# EAGLE design simon_shield (EAGLE 6.5.0)
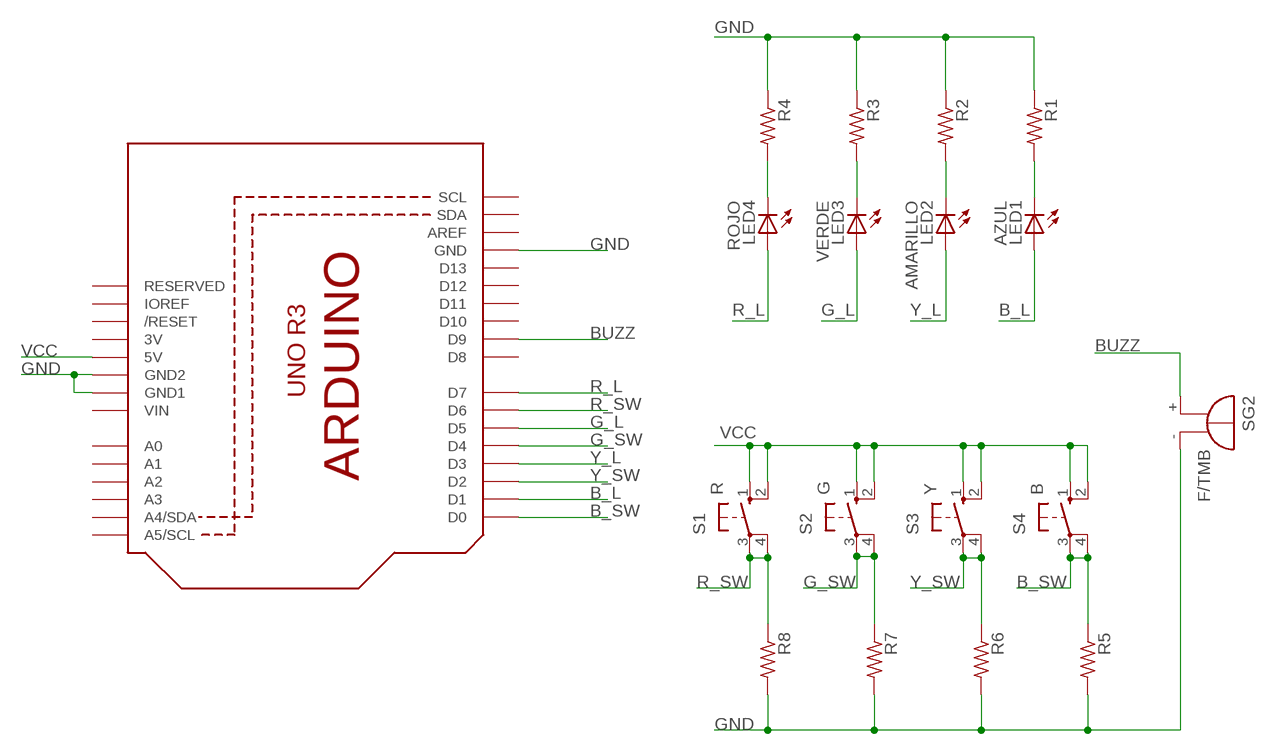
[diagram p0: schematic, sheet 1]

## Parts
LED1  AZUL  LED5MM  [LED5MM]
LED2  AMARILLO  LED5MM  [LED5MM]
LED3  VERDE  LED5MM  [LED5MM]
LED4  ROJO  LED5MM  [LED5MM]
R1  R-US_0207/10  [0207/10]
R2  R-US_0207/10  [0207/10]
R3  R-US_0207/10  [0207/10]
R4  R-US_0207/10  [0207/10]
R5  R-US_0207/10  [0207/10]
R6  R-US_0207/10  [0207/10]
R7  R-US_0207/10  [0207/10]
R8  R-US_0207/10  [0207/10]
S1  R  10-XX  [B3F-10XX]
S2  G  10-XX  [B3F-10XX]
S3  Y  10-XX  [B3F-10XX]
S4  B  10-XX  [B3F-10XX]
SG2  F/TMB  [F/TMB]
U1  ARDUINOR3-DIMENSION  [ARDUINOR3]

## Nets
B_L: LED1.A U1.D1
B_SW: R5.1 S4.3(P) S4.4(P1) U1.D0
BUZZ: SG2.+ U1.D9
G_L: LED3.A U1.D5
G_SW: R7.1 S2.3(P) S2.4(P1) U1.D4
GND: R1.1 R2.1 R3.1 R4.1 R5.2 R6.2 R7.2 R8.2 SG2.- U1.GND U1.GND1 U1.GND2
N$1: LED4.K(C) R4.2
N$2: LED3.K(C) R3.2
N$12: LED2.K(C) R2.2
N$13: LED1.K(C) R1.2
R_L: LED4.A U1.D7
R_SW: R8.1 S1.3(P) S1.4(P1) U1.D6
VCC: S1.1(S) S1.2(S1) S2.1(S) S2.2(S1) S3.1(S) S3.2(S1) S4.1(S) S4.2(S1) U1.5V
Y_L: LED2.A U1.D3
Y_SW: R6.1 S3.3(P) S3.4(P1) U1.D2
Unconnected: U1.A0 U1.A1 U1.A2 U1.A3 U1.A4(A4/SDA) U1.A5(A5/SCL) U1.AREF U1.D8 U1.D10 U1.D11 U1.D12 U1.D13 U1.IOREF U1.RESERVED U1.RESET(/RESET) U1.SCL U1.SDA

## Power pins joined to a net without a drawn wire
3V: U1.3V
VIN: U1.VIN

## Library data of the parts
LED1-LED4 = adafruit:LED: LED OSRAM: - CHIPLED LG R971, LG N971, LY N971, LG Q971, LY Q971, LO R971, LY R971 LH N974, LH R974 LS Q976, LO Q976, LY Q976 LO Q996 - Hyper CHIPLED LW Q18S LB Q993, LB Q99A, LB R99A - SideLED LS A670, LO A670, LY A670, LG A670, LP A670 LB A673, LV A673, LT A673, LW A673 LH A674 LY A675 LS A676, LA A676, LO A676, LY A676, LW A676 LS A679, LY A679, LG A679 - Hyper Micro SIDELED® LS Y876, LA Y876, LO Y876, LY Y876 LT Y87S - SmartLED LW L88C, LW L88S LB L89C, LB L89S, LG L890 LS L89K, LO L89K, LY L89K LS L896, LA L896, LO L896, LY L896 - TOPLED LS T670, LO T670, LY T670, LG T670, LP T670 LSG T670, LSP T670, LSY T670, LOP T670, LYG T670 LG T671, LOG T671, LSG T671 LB T673, LV T673, LT T673, LW T673 LH T674 LS T676, LA T676, LO T676, LY T676, LB T676, LH T676, LSB T676, LW T676 LB T67C, LV T67C, LT T67C, LS T67K, LO T67K, LY T67K, LW E67C LS E67B, LA E67B, LO E67B, LY E67B, LB E67C, LV E67C, LT E67C LW T67C LS T679, LY T679, LG T679 LS T770, LO T770, LY T770, LG T770, LP T770 LB T773, LV T773, LT T773, LW T773 LH T774 LS E675, LA E675, LY E675, LS T675 LS T776, LA T776, LO T776, LY T776, LB T776 LHGB T686 LT T68C, LB T68C - Hyper Mini TOPLED® LB M676 - Mini TOPLED Santana® LG M470 LS M47K, LO M47K, LY M47K Source: http://www.osram.convergy.de/
R1-R8 = adafruit:R-US_: RESISTOR, American symbol
S1-S4 = switch-omron:10-XX: OMRON SWITCH; MPN: B3F-1000; OC_FARNELL: 176432; OC_NEWARK: 36M3542
SG2 = buzzer:F/TMB: BUZZER Source: Buerklin; OC_FARNELL: unknown; OC_NEWARK: unknown
U1 = adafruit:ARDUINOR3: This is a new object for the new Arduino R3 - with extra pins that you may want to use (such as IOref, and duplicated A4/A5

## Board
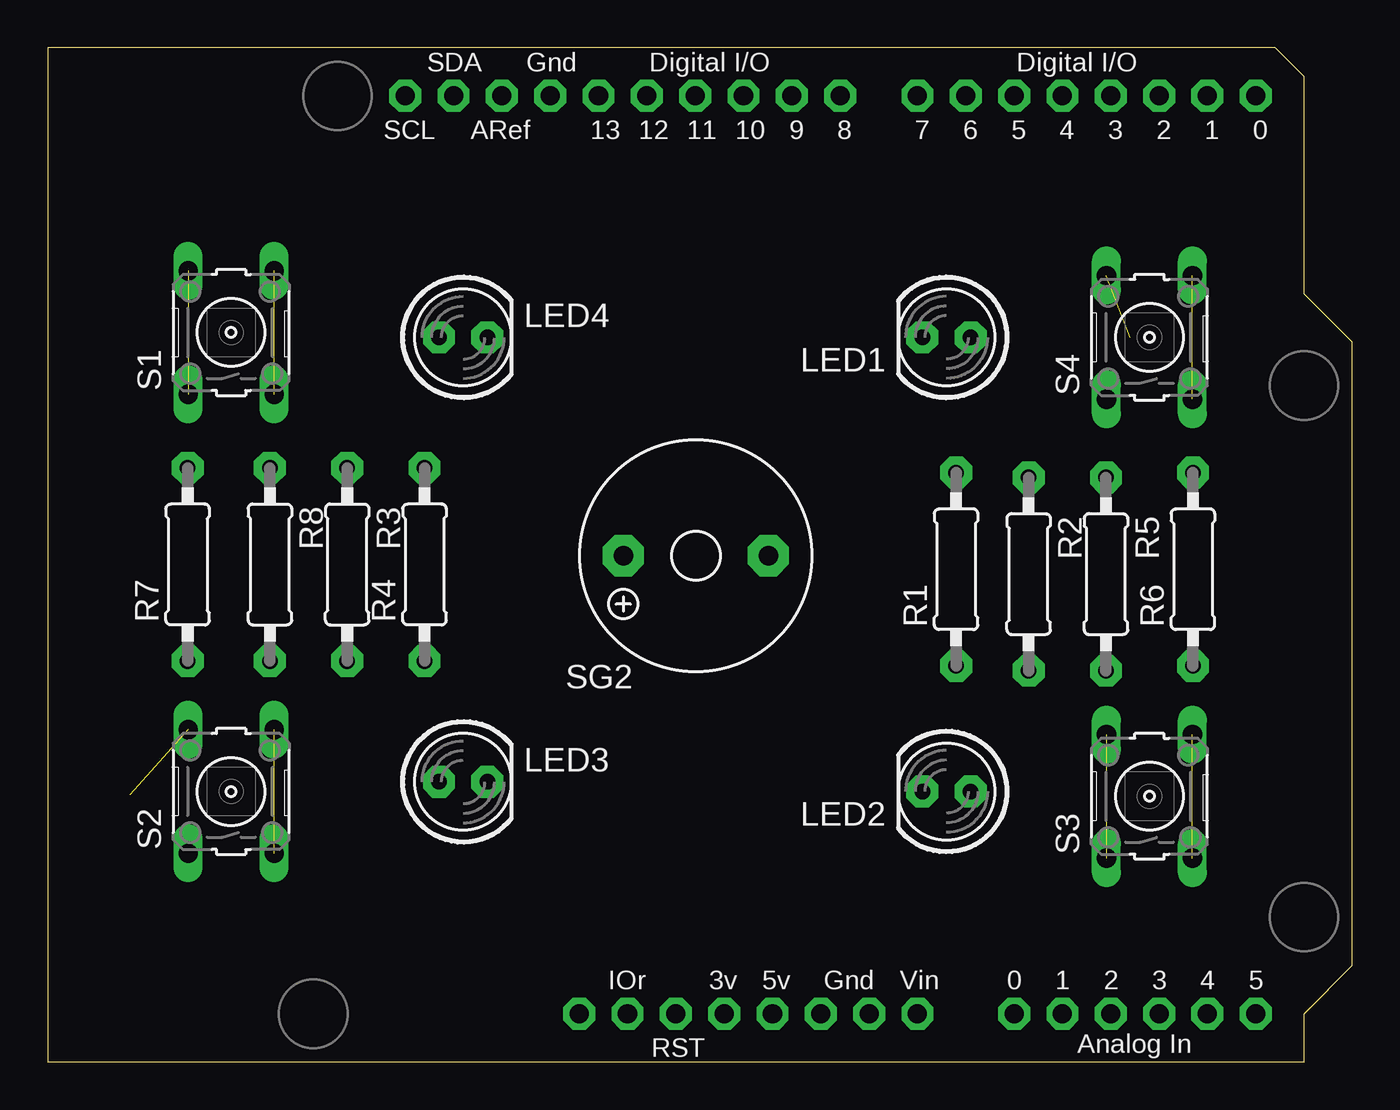
[diagram p1: board, top side]
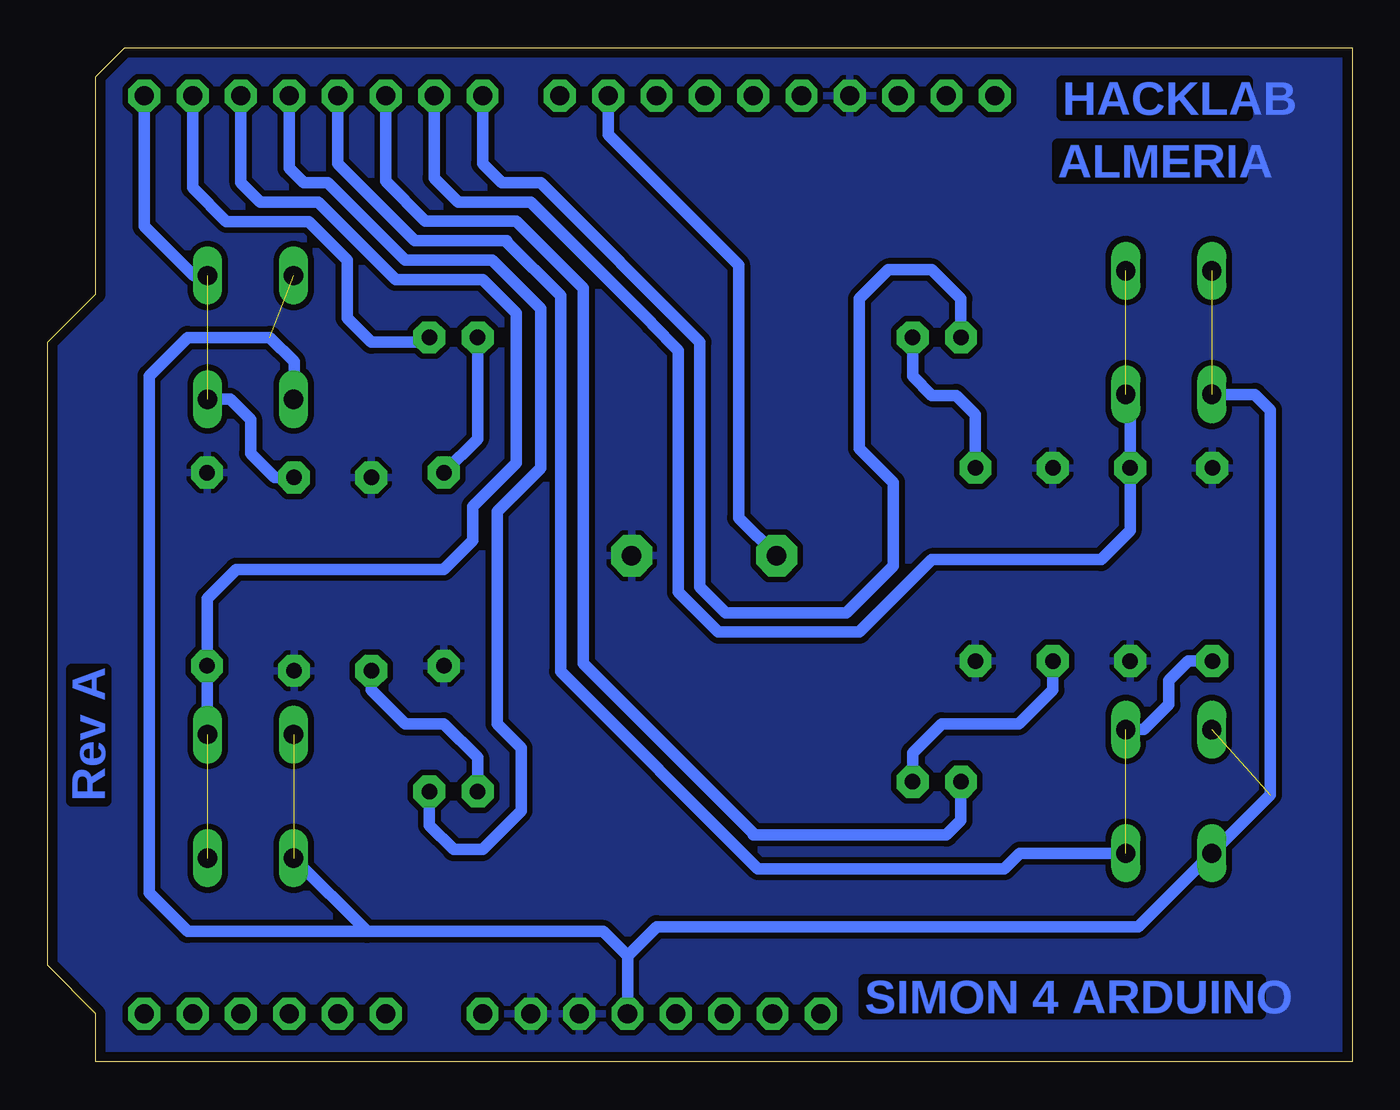
[diagram p2: board, bottom side, seen from below]

Size 68.58 x 53.34 mm. Coordinates in mm from the lower left corner, seen from the top.
Copper layers (1*16): Top 0.035mm / dielectric 1.5mm / Bottom 0.035mm
Design rules "copycentro_conservador": minimum track width 16mil, minimum drill 0.75mm, track to track 12mil, track to pad 12mil, pad to pad 12mil, via to via 16mil, smd to smd 12mil, copper to edge 20mil, drill to drill 16mil, minimum pad ring 10mil, minimum via ring 10mil, stop-mask expansion 12mil, vias tented up to drill 4mil, thermal gap 10mil

### Footprints (pad centres in the part's own frame; a part is rotated, then mirrored left to right if it is on the bottom)
LED5MM = drill 0.813 pad 1.676 octagon: A -1.27,0; K 1.27,0
0207/10 = drill 0.813 pad 1.676 octagon: 1 -5.08,0; 2 5.08,0
B3F-10XX = drill 1.016 long: 1 -3.251,2.261; 2 3.251,2.261; 3 -3.251,-2.261; 4 3.251,-2.261
F/TMB = drill 1.016 pad 2.159 octagon: + 3.81,0; - -3.81,0
ARDUINOR3 = drill 1 pad 1.676 octagon: 3V 35.56,2.54; 5V 38.1,2.54; A0 50.8,2.54; A1 53.34,2.54; A2 55.88,2.54; A3 58.42,2.54; A4 60.96,2.54; A5 63.5,2.54; AREF 23.876,50.8; D0 63.5,50.8; D1 60.96,50.8; D2 58.42,50.8; D3 55.88,50.8; D4 53.34,50.8; D5 50.8,50.8; D6 48.26,50.8; D7 45.72,50.8; D8 41.656,50.8; D9 39.116,50.8; D10 36.576,50.8; D11 34.036,50.8; D12 31.496,50.8; D13 28.956,50.8; GND 26.416,50.8; GND1 43.18,2.54; GND2 40.64,2.54; IOREF 30.48,2.54; RESERVED 27.94,2.54; RESET 33.02,2.54; SCL 18.796,50.8; SDA 21.336,50.8; VIN 45.72,2.54

### Placement (x,y rotation side)
LED1  47.24,38.1 180 top
LED2  47.24,14.22 180 top
LED3  21.84,14.73 0 top
LED4  21.84,38.1 0 top
R1  47.75,25.91 90 top
R2  51.56,25.65 270 top
R3  15.75,26.16 270 top
R4  19.81,26.16 90 top
R5  55.63,25.65 270 top
R6  60.2,25.91 90 top
R7  7.37,26.16 90 top
R8  11.68,26.16 270 top
S1  9.65,38.35 90 top
S2  9.65,14.22 90 top
S3  57.91,13.97 90 top
S4  57.91,38.1 90 top
SG2  34.07,26.62 180 top
U1  0,0 0 top

### Tracks (layer width: path | path; a pad name or v marks a point on that pad's centre or on a via)
B_L
  Bottom 0.61: LED1.A 48.51,37.85 51.56,37.85 52.83,39.12 52.83,42.16 54.86,44.2 59.18,44.2 60.96,45.97 U1.D1
B_SW  (1 unrouted)
  Bottom 0.61: S4.4 60.91,41.35 63.5,43.94 U1.D0 | S4.3 58.98,34.85 57.91,33.78 57.91,32 56.64,30.73 R5.1
BUZZ
  Bottom 0.61: U1.D9 39.12,48.77 32.26,41.91 32.26,28.61 SG2.+
G_L
  Bottom 0.61: LED3.A 20.57,12.7 21.34,11.94 31.42,11.94 | 31.42,11.94 31.5,11.94 | U1.D5 50.8,46.3 48.72,44.22 43.94,44.22 40.42,40.7 40.42,20.94 31.42,11.94
G_SW  (1 unrouted)
  Bottom 0.61: S2.3 17.48,10.97 18.29,10.16 31.24,10.16 41.62,20.54 41.62,40.28 44.45,43.12 44.45,43.18 49.28,43.18 53.34,47.24 U1.D4 | S2.4 10.97,17.48 9.65,18.8 9.65,20.07 8.64,21.08 R7.1
GND
  pour Bottom: 0,53.34 64.52,53.34 66.04,51.82 66.04,40.39 68.58,37.85 68.58,5.08 66.04,2.54 66.04,0 0,0
N$1
  Bottom 0.61: LED4.K 23.11,36.07 22.1,35.05 20.83,35.05 19.81,34.04 R4.2
N$2
  Bottom 0.61: LED3.K 23.11,16.26 21.59,17.78 17.53,17.78 15.75,19.56 R3.2
N$12
  Bottom 0.61: R2.2 51.56,19.56 49.78,17.78 47.75,17.78 45.97,16 LED2.K
N$13
  Bottom 0.61: LED1.K 45.97,32.77 R1.2
R_L
  Bottom 0.61: LED4.A 20.57,40.13 22.1,41.66 24.38,41.66 25.91,40.13 25.91,32.26 24.13,30.48 24.13,26.09 26.59,23.62 32.93,23.62 34.29,24.98 34.29,37.85 42.67,46.23 44.7,46.23 45.72,47.24 U1.D7
R_SW  (1 unrouted)
  Bottom 0.61: S1.3 11.68,34.87 R8.1 11.68,27.94 13.21,26.42 22.1,26.42 25.91,22.61 33.33,22.61 35.42,24.7 35.42,37.41 36.83,38.82 36.83,38.86 43.18,45.21 46.99,45.21 48.26,46.48 U1.D6
VCC  (4 unrouted)
  Bottom 0.61: U1.5V 38.1,5.59 | 38.1,5.59 39.37,6.86 51.79,6.86 | 51.79,6.86 S3.1 | 51.79,6.86 61.21,6.86 63.25,8.89 63.25,36.07 61.21,38.1 56.9,38.1 55.63,36.83 55.63,34.87 S4.1 | 38.1,5.59 36.58,7.11 11.25,7.11 S2.1 4.32,14.05 4.32,34.29 5.13,35.1 S1.1
Y_L
  Bottom 0.61: LED2.A 48.51,12.45 47.24,11.18 45.72,11.18 43.69,13.21 43.69,16.51 44.96,17.78 44.96,28.96 42.67,31.24 42.67,39.62 45.21,42.16 49.78,42.16 53.85,46.23 55.12,46.23 55.88,46.99 U1.D3
Y_SW  (1 unrouted)
  Bottom 0.61: S3.4 60.2,17.25 R6.1 60.2,24.38 58.67,25.91 47.75,25.91 46.23,27.43 46.23,29.21 43.94,31.5 43.94,39.37 45.72,41.15 50.29,41.15 54.36,45.21 57.4,45.21 58.42,46.23 U1.D2

### Text on the board
Bottom: HACKLAB | ALMERIA | Rev A | SIMON 4 ARDUINO